# EAGLE design Register (EAGLE 9.6.2)
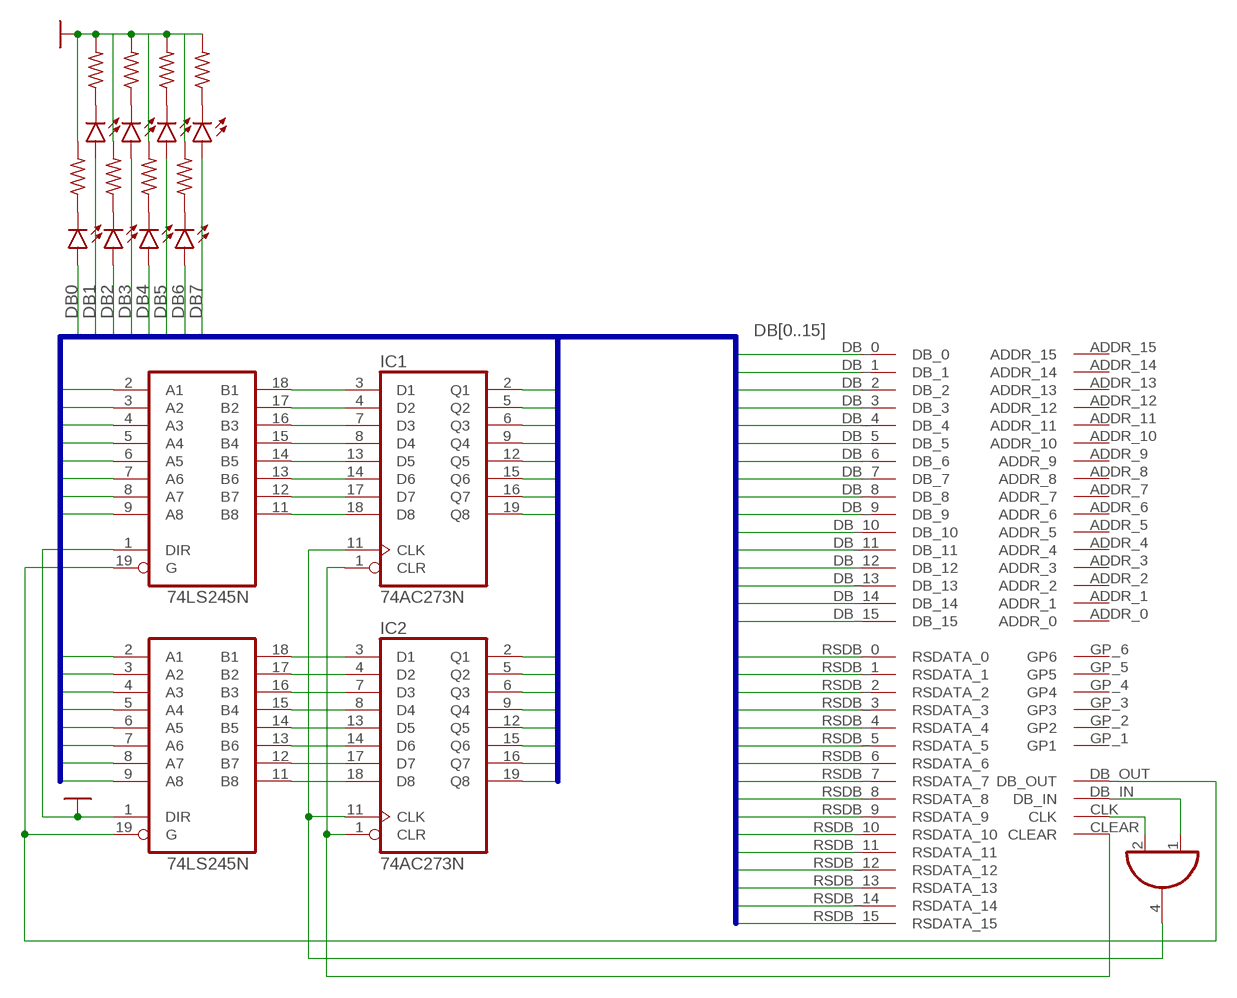
[diagram p0: schematic, sheet 1]

## Parts
IC1  74AC273N  [DIL20]
IC2  74AC273N  [DIL20]
IC4  74AHC1G08DCK  [SC70-5]
LED_A_REG_1  LED  LED5MM  [LED5MM]
LED_A_REG_2  LED  LED5MM  [LED5MM]
LED_A_REG_3  LED  LED5MM  [LED5MM]
LED_A_REG_4  LED  LED5MM  [LED5MM]
LED_A_REG_5  LED  LED5MM  [LED5MM]
LED_A_REG_6  LED  LED5MM  [LED5MM]
LED_A_REG_7  LED  LED5MM  [LED5MM]
LED_A_REG_8  LED  LED5MM  [LED5MM]
OUTPUT_BUFFER_REG_A  74LS245N  [DIL20]
OUTPUT_BUFFER_REG_A1  74LS245N  [DIL20]
R1  ~220  R-US_0204/7  [0204/7]
R2  ~220  R-US_0204/7  [0204/7]
R3  ~220  R-US_0204/7  [0204/7]
R4  ~220  R-US_0204/7  [0204/7]
R5  ~220  R-US_0204/7  [0204/7]
R6  ~220  R-US_0204/7  [0204/7]
R7  ~220  R-US_0204/7  [0204/7]
R8  ~220  R-US_0204/7  [0204/7]
U$1  BACKPLATE_INTERFACE  [BACK_INTERFACE-FOOT]

## Nets
DB0: IC1.2(Q1) LED_A_REG_1.A OUTPUT_BUFFER_REG_A1.2(A1) U$1.DB_0 U$1.RSDB_0(RSDATA_0)
DB1: IC1.5(Q2) LED_A_REG_2.A OUTPUT_BUFFER_REG_A1.3(A2) U$1.DB_1 U$1.RSDB_1(RSDATA_1)
DB2: IC1.6(Q3) LED_A_REG_3.A OUTPUT_BUFFER_REG_A1.4(A3) U$1.DB_2 U$1.RSDB_2(RSDATA_2)
DB3: IC1.9(Q4) LED_A_REG_4.A OUTPUT_BUFFER_REG_A1.5(A4) U$1.DB_3 U$1.RSDB_3(RSDATA_3)
DB4: IC1.12(Q5) LED_A_REG_5.A OUTPUT_BUFFER_REG_A1.6(A5) U$1.DB_4 U$1.RSDB_4(RSDATA_4)
DB5: IC1.15(Q6) LED_A_REG_6.A OUTPUT_BUFFER_REG_A1.7(A6) U$1.DB_5 U$1.RSDB_5(RSDATA_5)
DB6: IC1.16(Q7) LED_A_REG_7.A OUTPUT_BUFFER_REG_A1.8(A7) U$1.DB_6 U$1.RSDB_6(RSDATA_6)
DB7: IC1.19(Q8) LED_A_REG_8.A OUTPUT_BUFFER_REG_A1.9(A8) U$1.DB_7 U$1.RSDB_7(RSDATA_7)
DB8: IC2.2(Q1) OUTPUT_BUFFER_REG_A.2(A1) U$1.DB_8 U$1.RSDB_8(RSDATA_8)
DB9: IC2.5(Q2) OUTPUT_BUFFER_REG_A.3(A2) U$1.DB_9 U$1.RSDB_9(RSDATA_9)
DB10: IC2.6(Q3) OUTPUT_BUFFER_REG_A.4(A3) U$1.DB_10 U$1.RSDB_10(RSDATA_10)
DB11: IC2.9(Q4) OUTPUT_BUFFER_REG_A.5(A4) U$1.DB_11 U$1.RSDB_11(RSDATA_11)
DB12: IC2.12(Q5) OUTPUT_BUFFER_REG_A.6(A5) U$1.DB_12 U$1.RSDB_12(RSDATA_12)
DB13: IC2.15(Q6) OUTPUT_BUFFER_REG_A.7(A6) U$1.DB_13 U$1.RSDB_13(RSDATA_13)
DB14: IC2.16(Q7) OUTPUT_BUFFER_REG_A.8(A7) U$1.DB_14 U$1.RSDB_14(RSDATA_14)
DB15: IC2.19(Q8) OUTPUT_BUFFER_REG_A.9(A8) U$1.DB_15 U$1.RSDB_15(RSDATA_15)
GND: OUTPUT_BUFFER_REG_A1.1(DIR) OUTPUT_BUFFER_REG_A.1(DIR) R1.2 R2.2 R4.2 R6.2 R8.2
N$1: OUTPUT_BUFFER_REG_A1.19(G) OUTPUT_BUFFER_REG_A.19(G) U$1.DB_OUT
N$2: LED_A_REG_1.K(C) R1.1
N$3: IC1.18(D8) OUTPUT_BUFFER_REG_A1.11(B8)
N$4: IC1.17(D7) OUTPUT_BUFFER_REG_A1.12(B7)
N$5: IC1.14(D6) OUTPUT_BUFFER_REG_A1.13(B6)
N$6: IC1.13(D5) OUTPUT_BUFFER_REG_A1.14(B5)
N$7: IC1.8(D4) OUTPUT_BUFFER_REG_A1.15(B4)
N$8: IC1.7(D3) OUTPUT_BUFFER_REG_A1.16(B3)
N$9: IC1.4(D2) OUTPUT_BUFFER_REG_A1.17(B2)
N$10: IC1.3(D1) OUTPUT_BUFFER_REG_A1.18(B1)
N$11: IC2.18(D8) OUTPUT_BUFFER_REG_A.11(B8)
N$12: IC2.17(D7) OUTPUT_BUFFER_REG_A.12(B7)
N$13: IC2.14(D6) OUTPUT_BUFFER_REG_A.13(B6)
N$14: IC2.13(D5) OUTPUT_BUFFER_REG_A.14(B5)
N$15: IC2.8(D4) OUTPUT_BUFFER_REG_A.15(B4)
N$16: IC2.7(D3) OUTPUT_BUFFER_REG_A.16(B3)
N$17: IC2.4(D2) OUTPUT_BUFFER_REG_A.17(B2)
N$18: IC2.3(D1) OUTPUT_BUFFER_REG_A.18(B1)
N$19: IC4.2(I1) U$1.CLK
N$20: IC1.1(CLR) IC2.1(CLR) U$1.CLEAR
N$21: IC1.11(CLK) IC2.11(CLK) IC4.4(O)
N$22: IC4.1(I0) U$1.DB_IN
N$30: R5.2
N$31: R3.2
N$33: R7.2
N$120: LED_A_REG_2.K(C) R2.1
N$121: LED_A_REG_3.K(C) R3.1
N$122: LED_A_REG_4.K(C) R4.1
N$123: LED_A_REG_5.K(C) R5.1
N$124: LED_A_REG_6.K(C) R6.1
N$169: LED_A_REG_7.K(C) R7.1
N$176: LED_A_REG_8.K(C) R8.1
Unconnected: U$1.ADDR_0 U$1.ADDR_1 U$1.ADDR_2 U$1.ADDR_3 U$1.ADDR_4 U$1.ADDR_5 U$1.ADDR_6 U$1.ADDR_7 U$1.ADDR_8 U$1.ADDR_9 U$1.ADDR_10 U$1.ADDR_11 U$1.ADDR_12 U$1.ADDR_13 U$1.ADDR_14 U$1.ADDR_15 U$1.GP_1(GP1) U$1.GP_2(GP2) U$1.GP_3(GP3) U$1.GP_4(GP4) U$1.GP_5(GP5) U$1.GP_6(GP6) U$1.NC_0 U$1.NC_1

## Buses
DB[0..15]

## Power pins joined to a net without a drawn wire
GND: IC1.10(GND) IC2.10(GND) IC4.3(GND) OUTPUT_BUFFER_REG_A1.10(GND) OUTPUT_BUFFER_REG_A.10(GND) U$1.GND U$1.GND2(GND)
VCC: IC1.20(VCC) IC2.20(VCC) IC4.5(VCC) OUTPUT_BUFFER_REG_A1.20(VCC) OUTPUT_BUFFER_REG_A.20(VCC) U$1.VCC U$1.VCC2(VCC)

## Library data of the parts
IC1 IC2 = 74xx-eu:74*273: Octal D type FLIP FLOP, clear
IC4 = 74xx-little-de:74*1G08: 2-input AND gate
LED_A_REG_1-LED_A_REG_8 = led:LED: LED OSRAM: - CHIPLED LG R971, LG N971, LY N971, LG Q971, LY Q971, LO R971, LY R971 LH N974, LH R974 LS Q976, LO Q976, LY Q976 LO Q996 - Hyper CHIPLED LW Q18S LB Q993, LB Q99A, LB R99A - SideLED LS A670, LO A670, LY A670, LG A670, LP A670 LB A673, LV A673, LT A673, LW A673 LH A674 LY A675 LS A676, LA A676, LO A676, LY A676, LW A676 LS A679, LY A679, LG A679 - Hyper Micro SIDELED® LS Y876, LA Y876, LO Y876, LY Y876 LT Y87S - SmartLED LW L88C, LW L88S LB L89C, LB L89S, LG L890 LS L89K, LO L89K, LY L89K LS L896, LA L896, LO L896, LY L896 - TOPLED LS T670, LO T670, LY T670, LG T670, LP T670 LSG T670, LSP T670, LSY T670, LOP T670, LYG T670 LG T671, LOG T671, LSG T671 LB T673, LV T673, LT T673, LW T673 LH T674 LS T676, LA T676, LO T676, LY T676, LB T676, LH T676, LSB T676, LW T676 LB T67C, LV T67C, LT T67C, LS T67K, LO T67K, LY T67K, LW E67C LS E67B, LA E67B, LO E67B, LY E67B, LB E67C, LV E67C, LT E67C LW T67C LS T679, LY T679, LG T679 LS T770, LO T770, LY T770, LG T770, LP T770 LB T773, LV T773, LT T773, LW T773 LH T774 LS E675, LA E675, LY E675, LS T675 LS T776, LA T776, LO T776, LY T776, LB T776 LHGB T686 LT T68C, LB T68C - Hyper Mini TOPLED® LB M676 - Mini TOPLED Santana® LG M470 LS M47K, LO M47K, LY M47K Source: http://www.osram.convergy.de LUXEON: - LUMILED® LXK2-PW12-R00, LXK2-PW12-S00, LXK2-PW14-U00, LXK2-PW14-V00 LXK2-PM12-R00, LXK2-PM12-S00, LXK2-PM14-U00 LXK2-PE12-Q00, LXK2-PE12-R00, LXK2-PE12-S00, LXK2-PE14-T00, LXK2-PE14-U00 LXK2-PB12-K00, LXK2-PB12-L00, LXK2-PB12-M00, LXK2-PB14-N00, LXK2-PB14-P00, LXK2-PB14-Q00 LXK2-PR12-L00, LXK2-PR12-M00, LXK2-PR14-Q00, LXK2-PR14-R00 LXK2-PD12-Q00, LXK2-PD12-R00, LXK2-PD12-S00 LXK2-PH12-R00, LXK2-PH12-S00 LXK2-PL12-P00, LXK2-PL12-Q00, LXK2-PL12-R00 Source: www.luxeon.com KINGBRIGHT: KA-3528ASYC Source: www.kingbright.com
OUTPUT_BUFFER_REG_A OUTPUT_BUFFER_REG_A1 = 74xx-eu:74*245: Octal BUS TRANSCEIVER, 3-state
R1-R8 = rcl:R-US_: RESISTOR, American symbol; SPICEPREFIX: R
U$1 = Computer:BACKPLATE_INTERFACE

## Board
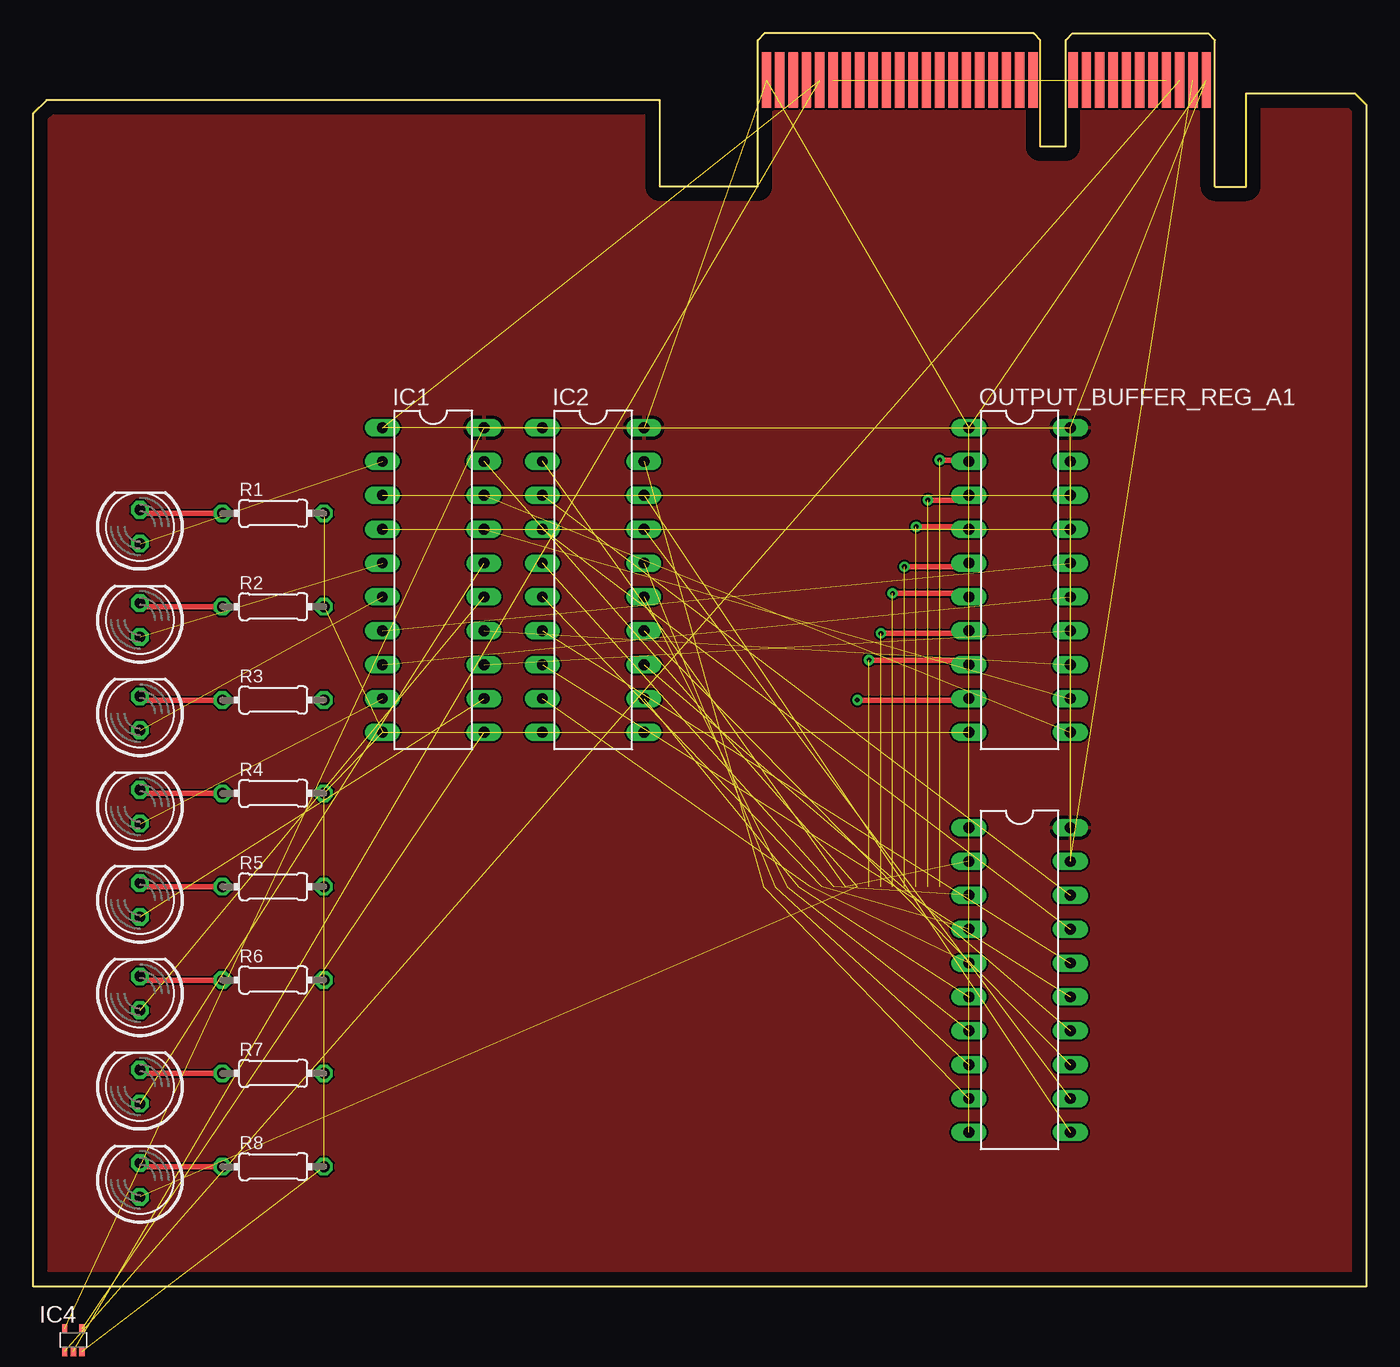
[diagram p1: board, top side]
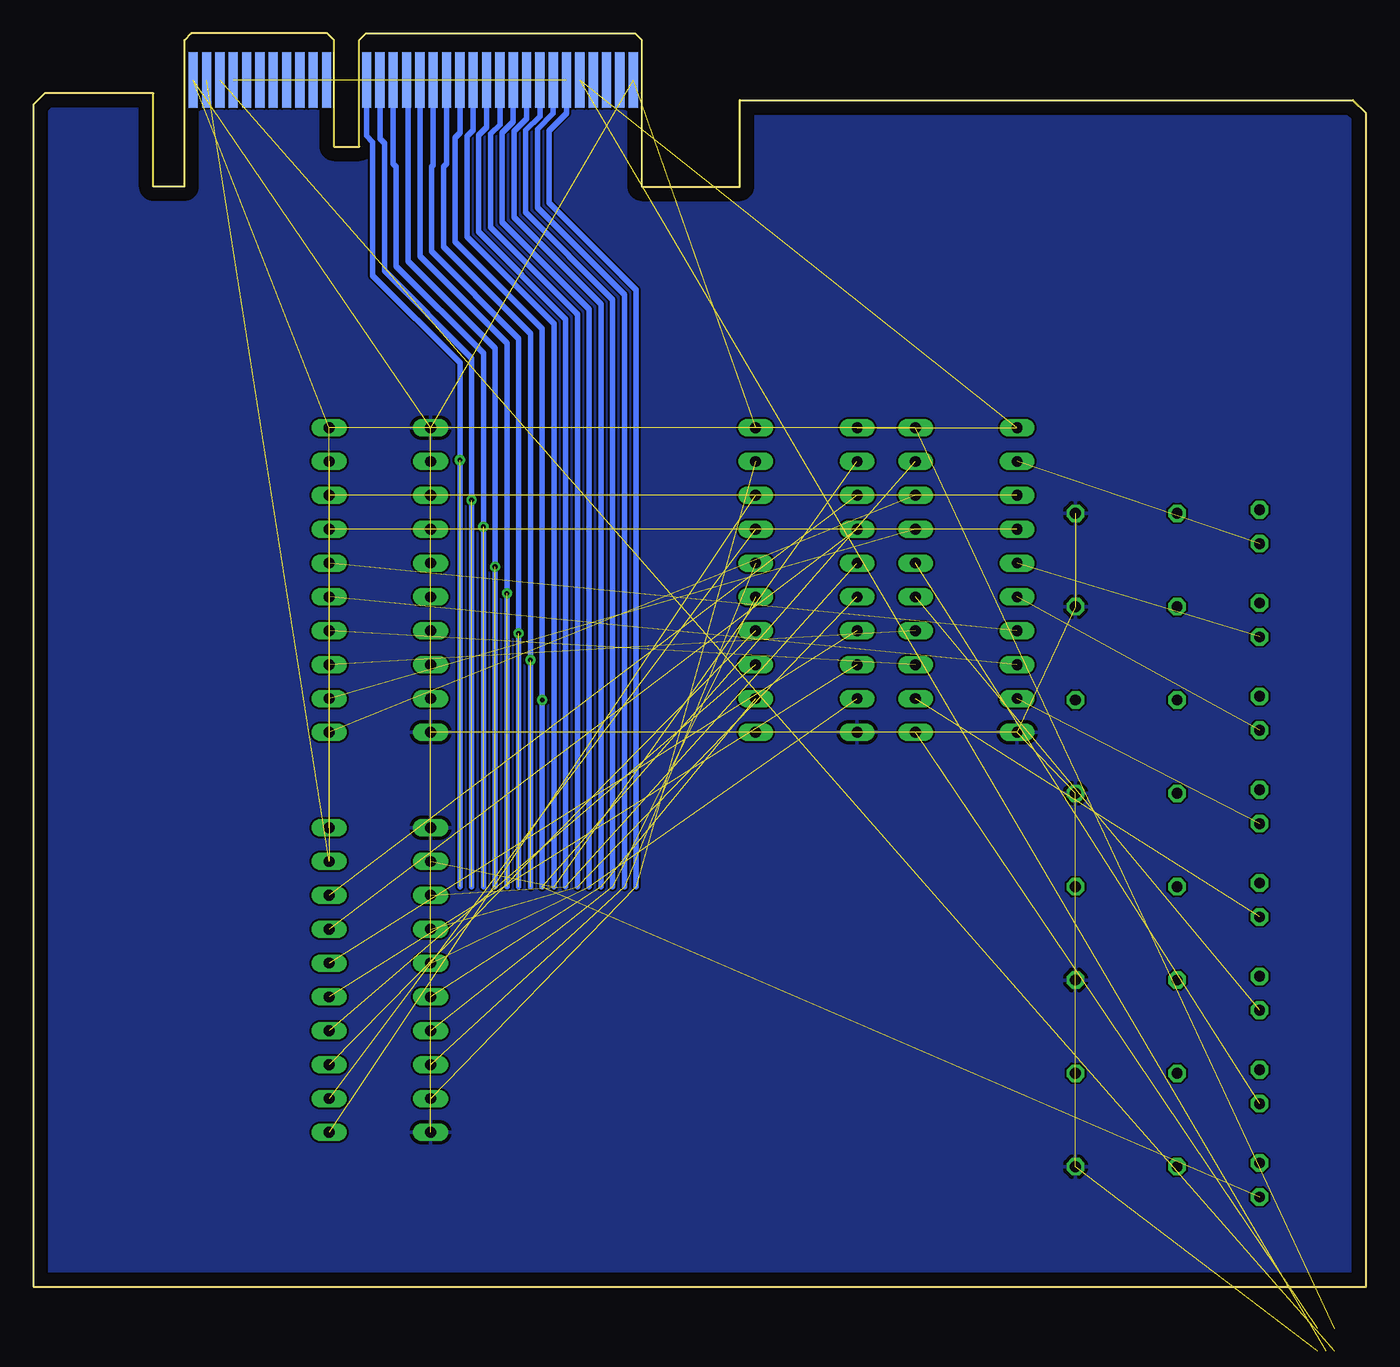
[diagram p2: board, bottom side, seen from below]

Size 100 x 94 mm. Coordinates in mm from the lower left corner, seen from the top.
Outline: 0,0 0,88 1,89 47,89 47,82.5 54.35,82.5 54.35,93.5 54.85,94 75.05,94 75.55,93.5 75.55,85.5 77.45,85.5 77.45,93.5 77.95,94 88.15,94 88.65,93.5 88.65,82.5 91,82.5 91,89.5 99.15,89.5 100,88.65 100,0 0,0
Copper layers (1*16): Top 0.035mm / dielectric 1.5mm / Bottom 0.035mm
Design rules "default": minimum track width 6mil, minimum drill 0.35mm, track to track 6mil, track to pad 6mil, pad to pad 6mil, via to via 6mil, smd to smd 6mil, copper to edge 40mil, drill to drill 6mil, minimum pad ring 10mil, minimum via ring 8mil, stop-mask expansion 4mil, vias tented up to drill 0mil, thermal gap 10mil

### Footprints (pad centres in the part's own frame; a part is rotated, then mirrored left to right if it is on the bottom)
DIL20 = drill 0.813 long: 1 -11.43,-3.81; 2 -8.89,-3.81; 3 -6.35,-3.81; 4 -3.81,-3.81; 5 -1.27,-3.81; 6 1.27,-3.81; 7 3.81,-3.81; 8 6.35,-3.81; 9 8.89,-3.81; 10 11.43,-3.81; 11 11.43,3.81; 12 8.89,3.81; 13 6.35,3.81; 14 3.81,3.81; 15 1.27,3.81; 16 -1.27,3.81; 17 -3.81,3.81; 18 -6.35,3.81; 19 -8.89,3.81; 20 -11.43,3.81
SC70-5 = smd 0.4 x 0.7: 1 -0.65,-0.85; 2 0,-0.85; 3 0.65,-0.85; 4 0.65,0.85; 5 -0.65,0.85
LED5MM = drill 0.813 octagon: A -1.27,0; K 1.27,0
0204/7 = drill 0.813 octagon: 1 -3.81,0; 2 3.81,0
BACK_INTERFACE-FOOT = smd 0.7 x 4.2: ADDR_0 13,0; ADDR_1 14,0; ADDR_2 15,0; ADDR_3 16,0; ADDR_4 17,0; ADDR_5 18,0; ADDR_6 19,0; ADDR_7 20,0; ADDR_8 21,0; ADDR_9 22,0; ADDR_10 23,0; ADDR_11 24,0; ADDR_12 25,0; ADDR_13 26,0; ADDR_14 27,0; ADDR_15 28,0; CLK 29,0; DB_IN 2,0; DB_OUT 1,0; GP_1 32,0; GP_2 31,0; GP_3 30,0; RSDB_0 3,0; RSDB_1 4,0; RSDB_2 5,0; RSDB_3 6,0; RSDB_4 7,0; RSDB_5 8,0; RSDB_6 9,0; RSDB_7 10,0; VCC 0,0; VCC2 33,0 | smd 0.7 x 4.2 bottom: CLEAR 29,0; DB_0 13,0; DB_1 14,0; DB_2 15,0; DB_3 16,0; DB_4 17,0; DB_5 18,0; DB_6 19,0; DB_7 20,0; DB_8 21,0; DB_9 22,0; DB_10 23,0; DB_11 24,0; DB_12 25,0; DB_13 26,0; DB_14 27,0; DB_15 28,0; GND 0,0; GND2 33,0; GP_4 32,0; GP_5 31,0; GP_6 30,0; NC_0 1,0; NC_1 2,0; RSDB_8 3,0; RSDB_9 4,0; RSDB_10 5,0; RSDB_11 6,0; RSDB_12 7,0; RSDB_13 8,0; RSDB_14 9,0; RSDB_15 10,0

### Placement (x,y rotation side)
IC1  30,53 270 top
IC2  42,53 270 top
IC4  3,-4 0 top  (outside the outline)
LED_A_REG_1  8,57 90 top
LED_A_REG_2  8,50 90 top
LED_A_REG_3  8,43 90 top
LED_A_REG_4  8,36 90 top
LED_A_REG_5  8,29 90 top
LED_A_REG_6  8,22 90 top
LED_A_REG_7  8,15 90 top
LED_A_REG_8  8,8 90 top
OUTPUT_BUFFER_REG_A  74,23 270 top
OUTPUT_BUFFER_REG_A1  74,53 270 top
R1  18,58 0 top
R2  18,51 0 top
R3  18,44 0 top
R4  18,37 0 top
R5  18,30 0 top
R6  18,23 0 top
R7  18,16 0 top
R8  18,9 0 top
U$1  88,90.5 180 top

### Tracks (layer width: path | path; a pad name or v marks a point on that pad's centre or on a via)
DB0  (via drill 0.35)  (3 unrouted)
  Top 0.406: OUTPUT_BUFFER_REG_A1.2 70.08,62 v68,62
  Bottom 0.406: U$1.DB_0 75,86.31 74.53,85.84 74.53,75.81 68,69.28 v68,62 68,30
DB1  (via drill 0.35)  (3 unrouted)
  Top 0.406: OUTPUT_BUFFER_REG_A1.3 69.84,59 v67.12,59
  Bottom 0.406: U$1.DB_1 74,86.1 73.65,85.75 73.65,76.18 67.12,69.65 v67.12,59 67.12,30
DB2  (via drill 0.35)  (3 unrouted)
  Top 0.406: OUTPUT_BUFFER_REG_A1.4 70,57 v66.23,57
  Bottom 0.406: U$1.DB_2 73,84.23 72.77,84 72.77,76.54 66.23,70.01 v66.23,57 66.23,30
DB3  (via drill 0.35)  (3 unrouted)
  Top 0.406: OUTPUT_BUFFER_REG_A1.5 69.92,54 v65.35,54
  Bottom 0.406: U$1.DB_3 71.88,90.38 71.88,76.91 65.35,70.38 v65.35,54 65.35,30
DB4  (via drill 0.35)  (3 unrouted)
  Top 0.406: OUTPUT_BUFFER_REG_A1.6 69.92,52 v64.47,52
  Bottom 0.406: 64.47,30 v64.47,52 64.47,70.74 71,77.27 U$1.DB_4
DB5  (via drill 0.35)  (3 unrouted)
  Top 0.406: OUTPUT_BUFFER_REG_A1.7 70,49 v63.59,49
  Bottom 0.406: U$1.DB_5 70,84.12 70.12,84 70.12,77.64 63.59,71.11 v63.59,49 63.59,30
DB6  (via drill 0.35)  (3 unrouted)
  Top 0.406: OUTPUT_BUFFER_REG_A1.8 69.84,47 v62.71,47
  Bottom 0.406: U$1.DB_6 69,84.23 69.23,84 69.23,78 62.71,71.47 v62.71,47 62.71,30
DB7  (via drill 0.35)  (3 unrouted)
  Top 0.406: OUTPUT_BUFFER_REG_A1.9 70.08,44 v61.82,44
  Bottom 0.406: U$1.DB_7 68,86.53 68.35,86.18 68.35,78.37 61.82,71.84 v61.82,44 61.82,30
DB8  (3 unrouted)
  Bottom 0.406: U$1.DB_8 67,86.74 67.47,86.27 67.47,78.73 60.94,72.2 60.94,30
DB9  (3 unrouted)
  Bottom 0.406: U$1.DB_9 66,86.95 66.59,86.36 66.59,79.1 60.06,72.57 60.06,30
DB10  (3 unrouted)
  Bottom 0.406: U$1.DB_10 65,87.16 65.71,86.45 65.71,79.47 59.18,72.94 59.18,30
DB11  (3 unrouted)
  Bottom 0.406: U$1.DB_11 64,87.37 64.82,86.55 64.82,79.83 58.29,73.3 58.29,30
DB12  (3 unrouted)
  Bottom 0.406: U$1.DB_12 63,87.58 63.94,86.64 63.94,80.2 57.41,73.67 57.41,30
DB13  (3 unrouted)
  Bottom 0.406: U$1.DB_13 62,87.79 63.06,86.73 63.06,80.56 56.53,74.03 56.53,30
DB14  (3 unrouted)
  Bottom 0.406: U$1.DB_14 61,88 62.18,86.82 62.18,80.93 55.65,74.4 55.65,30
DB15  (3 unrouted)
  Bottom 0.406: U$1.DB_15 60,88 61.29,86.71 61.29,81.29 54.76,74.76 54.76,30
GND  (13 unrouted)
  pour Bottom: 0,0 0,88 1,89 47,89 47,82.5 54.35,82.5 54.35,93.5 54.85,94 75.05,94 75.55,93.5 75.55,85.5 77.45,85.5 77.45,93.5 77.95,94 88.15,94 88.65,93.5 88.65,82.5 91,82.5 91,89.5 99.15,89.5 100,88.65 100,0
N$1  (2 unrouted)
N$2
  Top 0.406: R1.1 8.27,58 LED_A_REG_1.K
N$3  (1 unrouted)
N$4  (1 unrouted)
N$5  (1 unrouted)
N$6  (1 unrouted)
N$7  (1 unrouted)
N$8  (1 unrouted)
N$9  (1 unrouted)
N$10  (1 unrouted)
N$11  (1 unrouted)
N$12  (1 unrouted)
N$13  (1 unrouted)
N$14  (1 unrouted)
N$15  (1 unrouted)
N$16  (1 unrouted)
N$17  (1 unrouted)
N$18  (1 unrouted)
N$19  (1 unrouted)
N$20  (2 unrouted)
N$21  (2 unrouted)
N$22  (1 unrouted)
N$120
  Top 0.406: R2.1 8.27,51 LED_A_REG_2.K
N$121
  Top 0.406: R3.1 8.27,44 LED_A_REG_3.K
N$122
  Top 0.406: R4.1 8.27,37 LED_A_REG_4.K
N$123
  Top 0.406: R5.1 8.27,30 LED_A_REG_5.K
N$124
  Top 0.406: R6.1 8.27,23 LED_A_REG_6.K
N$169
  Top 0.406: R7.1 8.27,16 LED_A_REG_7.K
N$176
  Top 0.406: R8.1 8.27,9 LED_A_REG_8.K
VCC  (6 unrouted)
  pour Top: 0,0 0,88 1,89 47,89 47,82.5 54.35,82.5 54.35,93.5 54.85,94 75.05,94 75.55,93.5 75.55,85.5 77.45,85.5 77.45,93.5 77.95,94 88.15,94 88.65,93.5 88.65,82.5 91,82.5 91,89.5 99.15,89.5 100,88.65 100,0